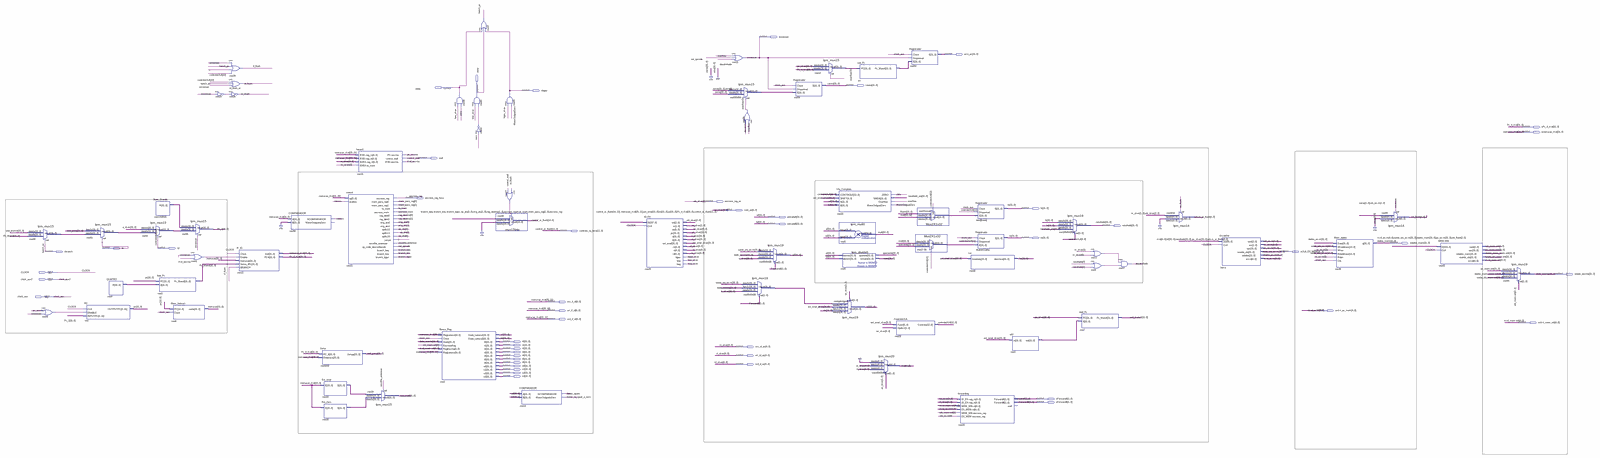
[diagram p0: schematic sheet, whole]
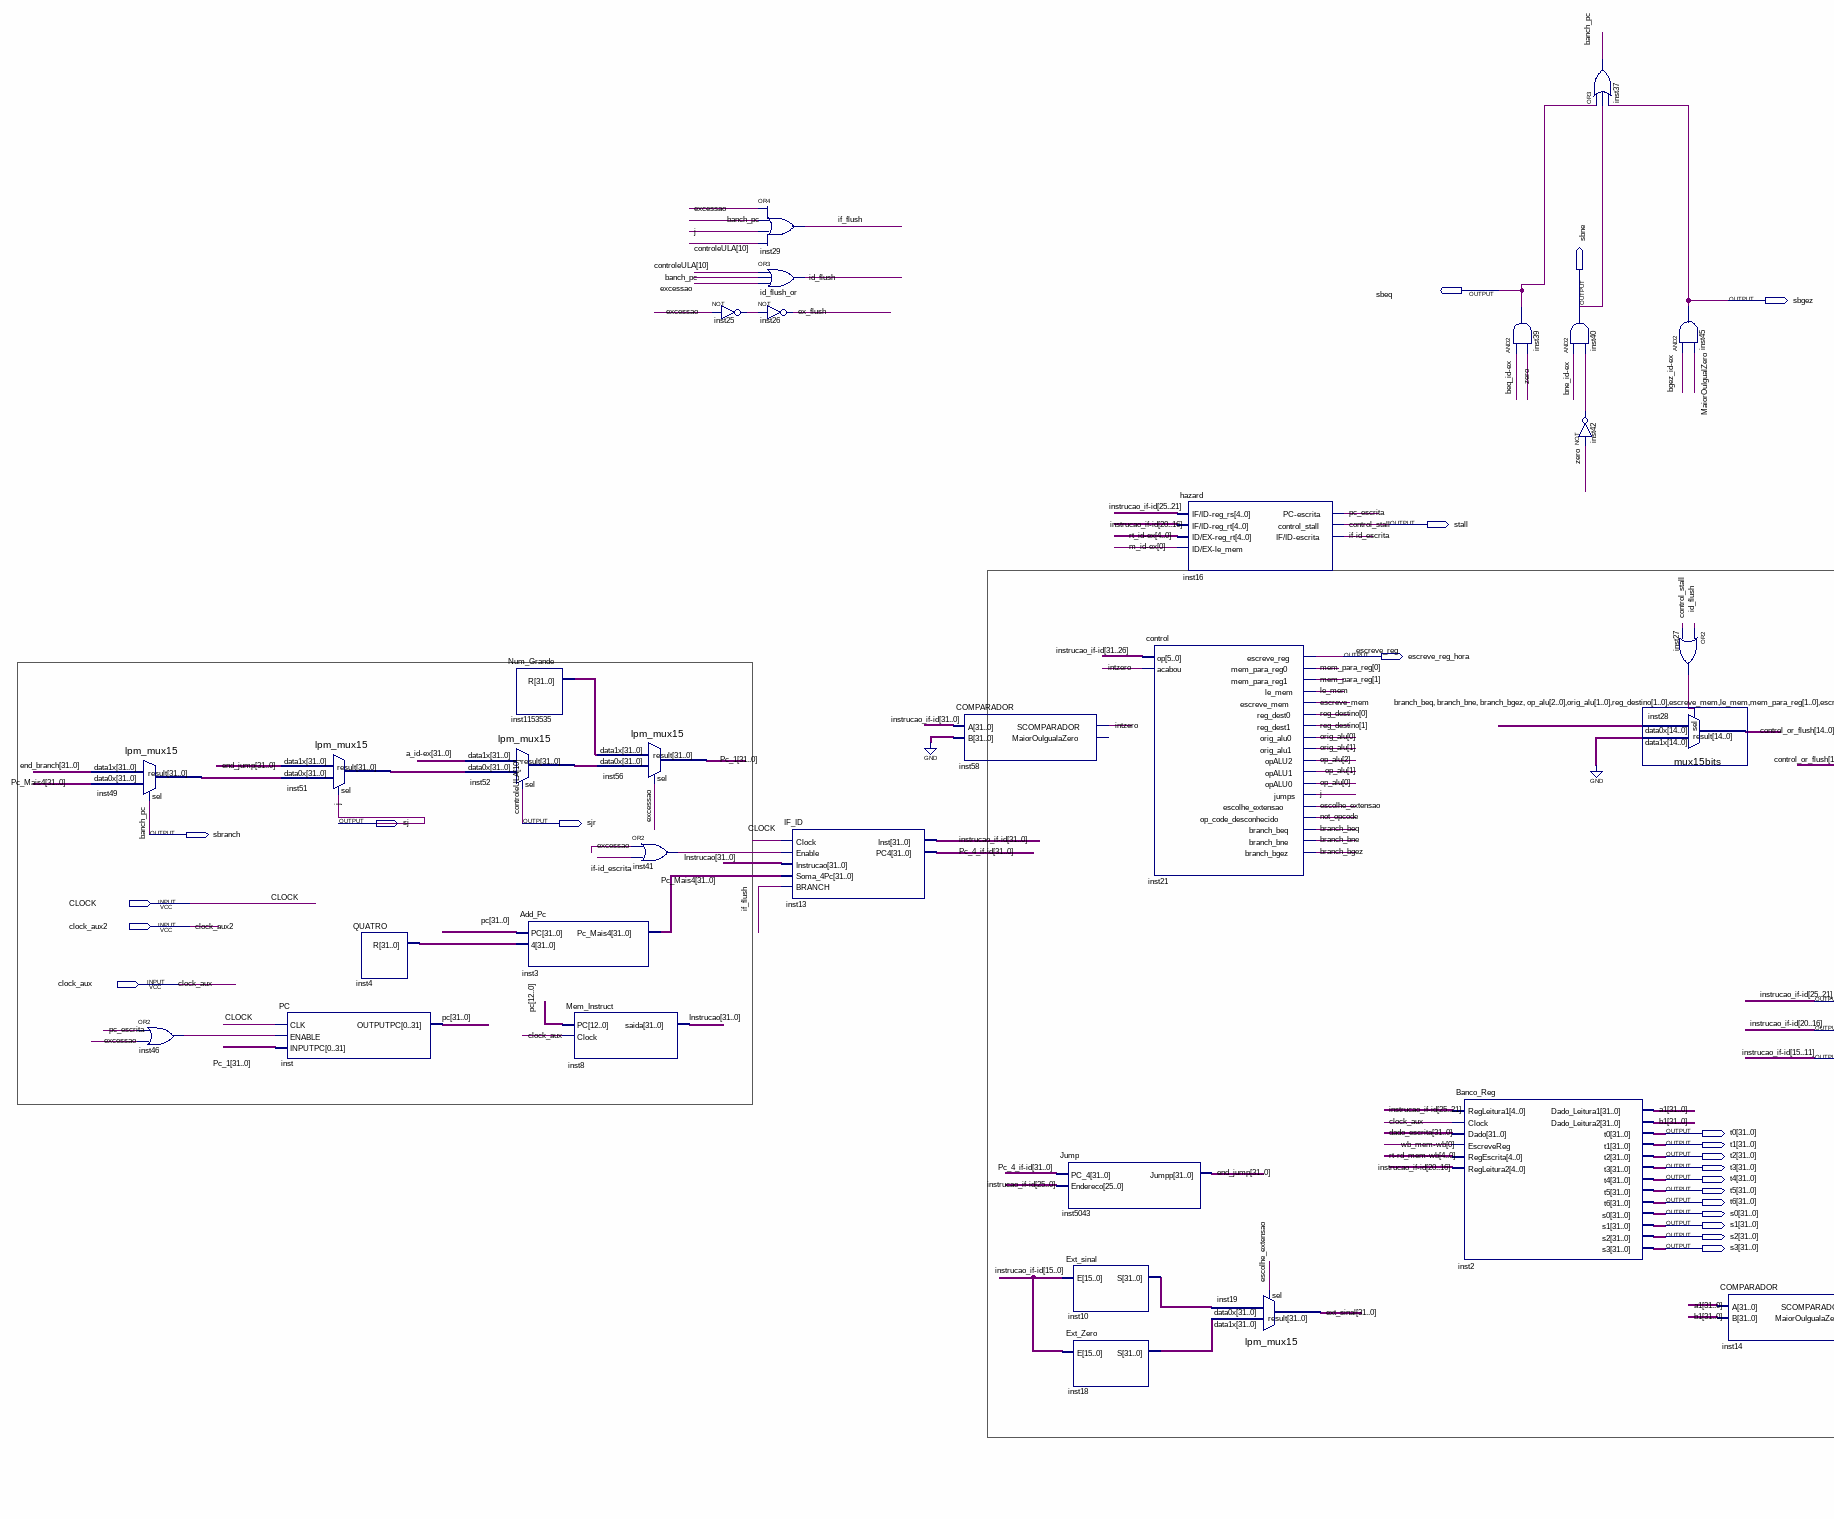
[diagram p1: schematic sheet, left part]
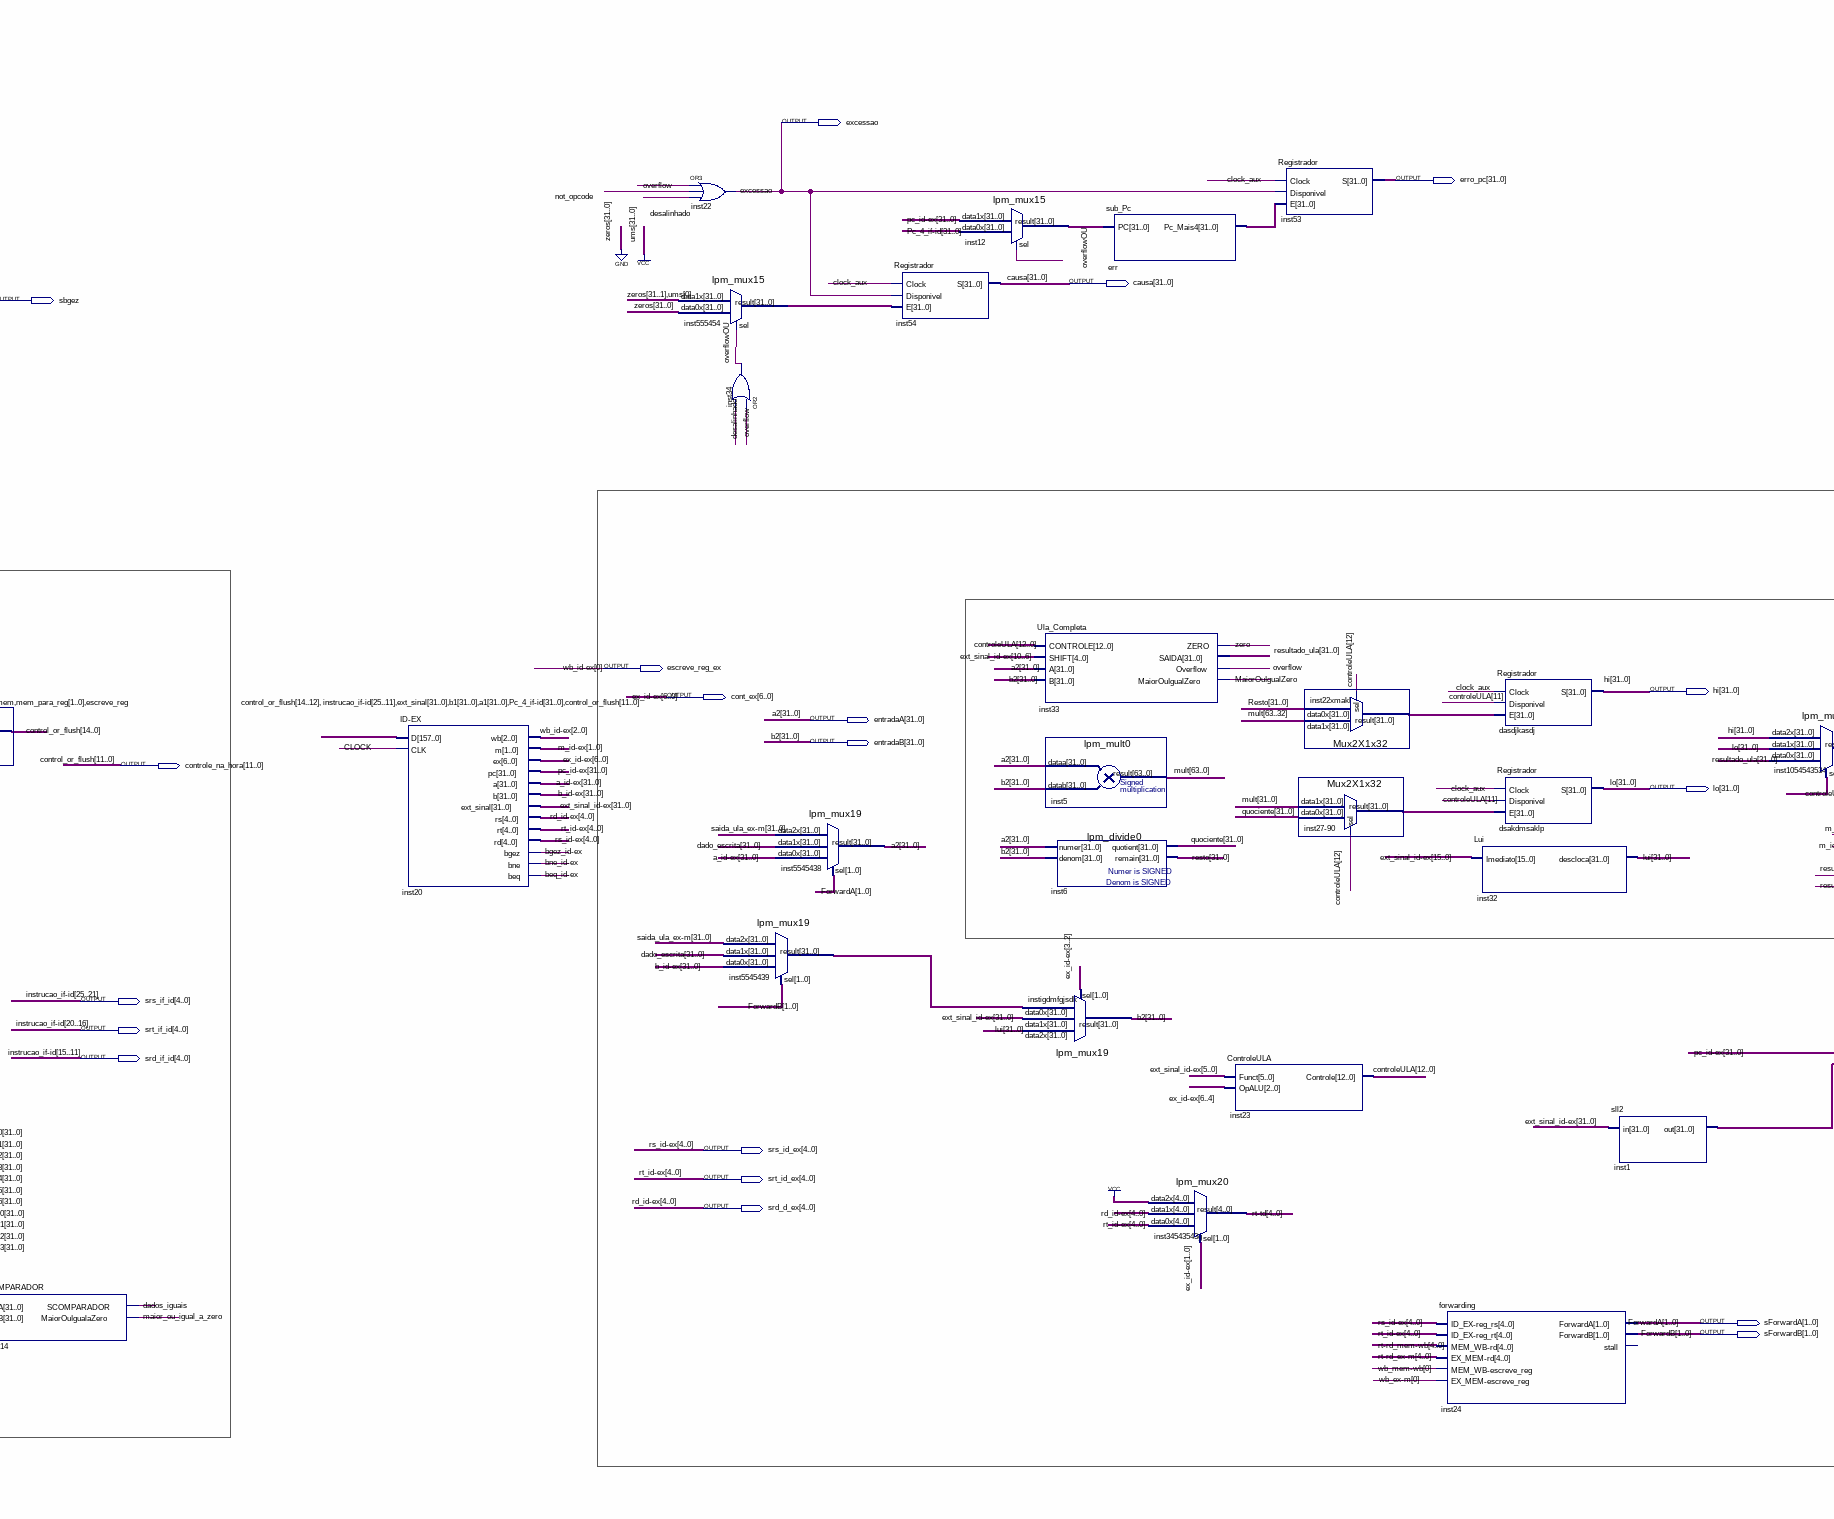
[diagram p2: schematic sheet, centre part]
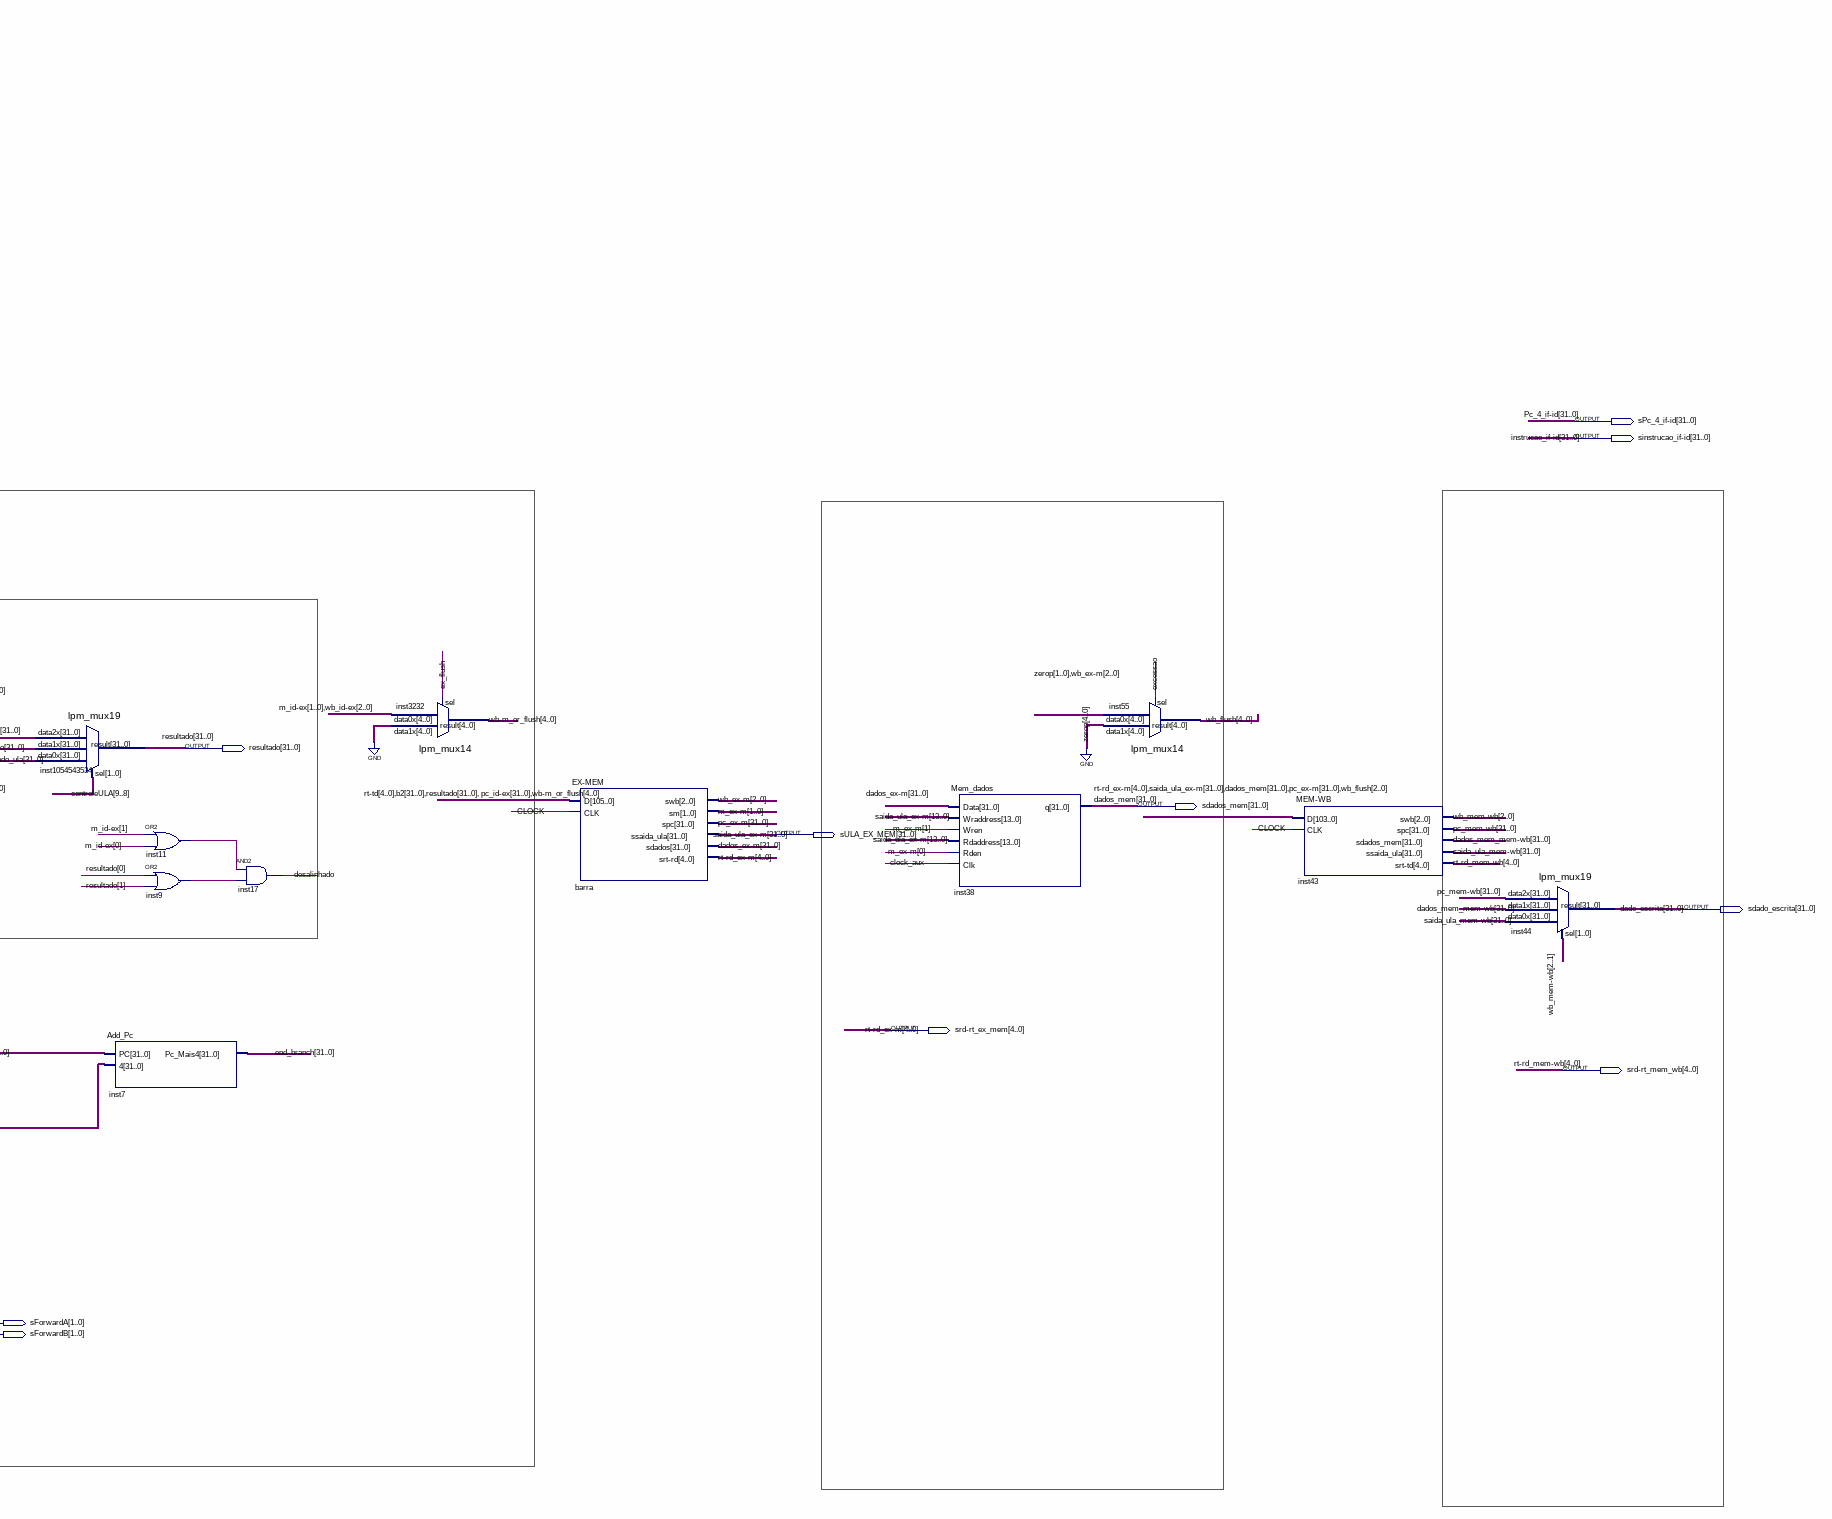
[diagram p3: schematic sheet, right part]
// Quartus schematic tudo.bdf as structural Verilog: 66 symbols, 48 pins
module tudo (
  input  CLOCK,
  input  clock_aux2,
  input  clock_aux,
  output excessao,
  output [31:0] erro_pc,
  output [31:0] causa,
  output sbeq,
  output sbgez,
  output sbne,
  output [31:0] \sPc_4_if-id ,
  output [31:0] \sinstrucao_if-id ,
  output stall,
  output escreve_reg_hora,
  output escreve_reg_ex,
  output [31:0] hi,
  output [6:0] cont_ex,
  output [31:0] entradaA,
  output [31:0] entradaB,
  output [31:0] resultado,
  output [11:0] controle_na_hora,
  output [31:0] lo,
  output [31:0] sdados_mem,
  output sj,
  output sjr,
  output sbranch,
  output [31:0] sULA_EX_MEM,
  output [31:0] sdado_escrita,
  output [4:0] srs_if_id,
  output [4:0] srt_if_id,
  output [4:0] \srd-rt_ex_mem ,
  output [4:0] srd_if_id,
  output [4:0] \srd-rt_mem_wb ,
  output [31:0] t0,
  output [31:0] t1,
  output [4:0] srs_id_ex,
  output [31:0] t2,
  output [31:0] t3,
  output [31:0] t4,
  output [4:0] srt_id_ex,
  output [31:0] t5,
  output [31:0] t6,
  output [4:0] srd_d_ex,
  output [31:0] s0,
  output [31:0] s1,
  output [31:0] s2,
  output [31:0] s3,
  output [1:0] sForwardA,
  output [1:0] sForwardB
);

  wire \beq_id-ex , \bgez_id-ex , \bne_id-ex , branch_beq, branch_bgez, branch_bne, dados_iguais,
       desalinhado, escolhe_extensao, escreve_mem, ex_flush, id_flush, \if-id_escrita , if_flush, inst9_out,
       inst11_out, inst25_out, inst27_out, inst41_out, inst42_out, inst46_out, intzero, le_mem,
       maior_ou_igual_a_zero, MaiorOuIgualZero, not_opcode, overflow, overflowOU, pc_escrita, zero;
  wire [1:0] \m_ex-m , \m_id-ex , mem_para_reg, orig_alu, reg_destino;
  wire [2:0] op_alu, \wb_ex-m , \wb_mem-wb ;
  wire [2:1] \wb_id-ex ;
  wire [4:0] \rt-td , \wb-m_or_flush , wb_flush;
  wire [12:0] controleULA;
  wire [14:12] control_or_flush;
  wire [31:0] a1, \a_id-ex , b1, \b_id-ex , \dados_ex-m , \dados_mem_mem-wb , end_branch, end_jump,
       err_pc_mais4, ext_sinal, \ext_sinal_id-ex , inst1_out, inst4_r, inst10_s, inst12_result, inst18_s,
       inst22xmakl_result, inst27_90_result, inst49_result, inst51_result, inst52_result, inst555454_result,
       inst1153535_r, inst5545439_result, Instrucao, lui, pc, Pc_1, \pc_ex-m , \pc_id-ex , Pc_Mais4,
       \pc_mem-wb , quociente, Resto, resultado_ula, \saida_ula_mem-wb ;
  wire [63:0] mult;

  lpm_mux15 inst49 (.data1x(end_branch), .data0x(Pc_Mais4), .sel(sbranch), .result(inst49_result));
  or inst46 (inst46_out, pc_escrita, excessao);
  lpm_mux15 inst51 (.data1x(end_jump), .data0x(inst49_result), .sel(sj), .result(inst51_result));
  PC inst (.CLK(CLOCK), .ENABLE(inst46_out), .INPUTPC(Pc_1), .OUTPUTPC(pc));
  QUATRO inst4 (.R(inst4_r));
  lpm_mux15 inst52 (.data1x(\a_id-ex ), .data0x(inst51_result), .sel(sjr), .result(inst52_result));
  Num_Grande inst1153535 (.R(inst1153535_r));
  Add_Pc inst3 (.PC(pc), .\4 (inst4_r), .Pc_Mais4(Pc_Mais4));
  Mem_Instruct inst8 (.PC(pc[12:0]), .Clock(clock_aux), .saida(Instrucao));
  lpm_mux15 inst56 (.data1x(inst1153535_r), .data0x(inst52_result), .sel(excessao), .result(Pc_1));
  or inst41 (inst41_out, excessao, \if-id_escrita );
  not inst25 (inst25_out, excessao);
  or inst29 (if_flush, excessao, sbranch, sj, sjr);
  or id_flush_or (id_flush, sjr, sbranch, excessao);
  not inst26 (ex_flush, inst25_out);
  IF_ID inst13 (
    .Clock(CLOCK), .Enable(inst41_out), .Instrucao(Instrucao), .Soma_4Pc(Pc_Mais4), .BRANCH(if_flush),
    .Inst(\sinstrucao_if-id ), .PC4(\sPc_4_if-id ));
  COMPARADOR inst58 (.A(\sinstrucao_if-id ), .B({32{1'b0}}), .SCOMPARADOR(intzero));  // open: MaiorOuIgualaZero
  Jump inst5043 (.PC_4(\sPc_4_if-id ), .Endereco(\sinstrucao_if-id [25:0]), .Jumpp(end_jump));
  Ext_sinal inst10 (.E(\sinstrucao_if-id [15:0]), .S(inst10_s));
  Ext_Zero inst18 (.E(\sinstrucao_if-id [15:0]), .S(inst18_s));
  control inst21 (
    .op(\sinstrucao_if-id [31:26]), .acabou(intzero), .escreve_reg(escreve_reg_hora),
    .mem_para_reg0(mem_para_reg[0]), .mem_para_reg1(mem_para_reg[1]), .le_mem(le_mem),
    .escreve_mem(escreve_mem), .reg_dest0(reg_destino[0]), .reg_dest1(reg_destino[1]),
    .orig_alu0(orig_alu[0]), .orig_alu1(orig_alu[1]), .opALU2(op_alu[2]), .opALU1(op_alu[1]),
    .opALU0(op_alu[0]), .jumps(sj), .escolhe_extensao(escolhe_extensao), .op_code_desconhecido(not_opcode),
    .branch_beq(branch_beq), .branch_bne(branch_bne), .branch_bgez(branch_bgez));
  hazard inst16 (
    .\IF/ID-reg_rs (\sinstrucao_if-id [25:21]), .\IF/ID-reg_rt (\sinstrucao_if-id [20:16]),
    .\ID/EX-reg_rt (srt_id_ex), .\ID/EX-le_mem (\m_id-ex [0]), .\PC-escrita (pc_escrita),
    .control_stall(stall), .\IF/ID-escrita (\if-id_escrita ));
  lpm_mux15 inst19 (.data1x(inst18_s), .data0x(inst10_s), .sel(escolhe_extensao), .result(ext_sinal));
  Banco_Reg inst2 (
    .RegLeitura1(\sinstrucao_if-id [25:21]), .Clock(clock_aux), .Dado(sdado_escrita),
    .EscreveReg(\wb_mem-wb [0]), .RegEscrita(\srd-rt_mem_wb ), .RegLeitura2(\sinstrucao_if-id [20:16]),
    .Dado_Leitura1(a1), .Dado_Leitura2(b1), .t0(t0), .t1(t1), .t2(t2), .t3(t3), .t4(t4), .t5(t5), .t6(t6),
    .s0(s0), .s1(s1), .s2(s2), .s3(s3));
  and inst39 (sbeq, \beq_id-ex , zero);
  and inst40 (sbne, \bne_id-ex , inst42_out);
  not inst42 (inst42_out, zero);
  or inst37 (sbranch, sbeq, sbne, sbgez);
  mux15bits inst28 (
    .data1x({15{1'b0}}),
    .data0x({branch_beq, branch_bne, branch_bgez, op_alu, orig_alu, reg_destino, escreve_mem, le_mem, mem_para_reg, escreve_reg_hora}),
    .sel(inst27_out), .result({control_or_flush, controle_na_hora}));
  and inst45 (sbgez, \bgez_id-ex , MaiorOuIgualZero);
  or inst27 (inst27_out, id_flush, stall);
  COMPARADOR inst14 (.A(a1), .B(b1), .SCOMPARADOR(dados_iguais), .MaiorOuIgualaZero(maior_ou_igual_a_zero));
  \ID-EX  inst20 (
    .D({control_or_flush, \sinstrucao_if-id [25:11], ext_sinal, b1, a1, \sPc_4_if-id , controle_na_hora}),
    .CLK(CLOCK), .wb({\wb_id-ex , escreve_reg_ex}), .m(\m_id-ex ), .ex(cont_ex), .pc(\pc_id-ex ),
    .a(\a_id-ex ), .b(\b_id-ex ), .ext_sinal(\ext_sinal_id-ex ), .rs(srd_d_ex), .rt(srt_id_ex),
    .rd(srs_id_ex), .bgez(\bgez_id-ex ), .bne(\bne_id-ex ), .beq(\beq_id-ex ));
  or inst22 (excessao, overflow, not_opcode, desalinhado);
  lpm_mux15 inst555454 (
    .data1x(32'b00000000000000000000000000000001), .data0x({32{1'b0}}), .sel(overflowOU),
    .result(inst555454_result));
  or inst34 (overflowOU, overflow, desalinhado);
  lpm_mux19 inst5545439 (
    .data2x(sULA_EX_MEM), .data1x(sdado_escrita), .data0x(\b_id-ex ), .sel(sForwardB),
    .result(inst5545439_result));
  lpm_mux19 inst5545438 (
    .data2x(sULA_EX_MEM), .data1x(sdado_escrita), .data0x(\a_id-ex ), .sel(sForwardA), .result(entradaA));
  Registrador inst54 (.Clock(clock_aux), .Disponivel(excessao), .E(inst555454_result), .S(causa));
  lpm_mux15 inst12 (.data1x(\pc_id-ex ), .data0x(\sPc_4_if-id ), .sel(overflowOU), .result(inst12_result));
  Ula_Completa inst33 (
    .CONTROLE({controleULA[12:11], sjr, controleULA[9:0]}), .SHIFT(\ext_sinal_id-ex [10:6]), .A(entradaA),
    .B(entradaB), .ZERO(zero), .SAIDA(resultado_ula), .Overflow(overflow), .MaiorOuIgualZero(MaiorOuIgualZero));
  lpm_mux19 instigdmfgjsdk (
    .data2x(lui), .data1x(\ext_sinal_id-ex ), .data0x(inst5545439_result), .sel(cont_ex[3:2]),
    .result(entradaB));
  lpm_mult0 inst5 (.dataa(entradaA), .datab(entradaB), .result(mult));
  lpm_divide0 inst6 (.numer(entradaA), .denom(entradaB), .quotient(quociente), .remain(Resto));
  sub_Pc err (.PC(inst12_result), .Pc_Mais4(err_pc_mais4));
  lpm_mux20 inst34543543g (
    .data2x({5{1'b1}}), .data1x(srd_d_ex), .data0x(srt_id_ex), .sel(cont_ex[1:0]), .result(\rt-td ));
  ControleULA inst23 (
    .Funct(\ext_sinal_id-ex [5:0]), .OpALU(cont_ex[6:4]),
    .Controle({controleULA[12:11], sjr, controleULA[9:0]}));
  Registrador inst53 (.Clock(clock_aux), .Disponivel(excessao), .E(err_pc_mais4), .S(erro_pc));
  Mux2X1x32 inst22xmakl (.data1x(mult[63:32]), .data0x(Resto), .sel(controleULA[12]), .result(inst22xmakl_result));
  Mux2X1x32 \inst27-90  (.data1x(mult[31:0]), .data0x(quociente), .sel(controleULA[12]), .result(inst27_90_result));
  forwarding inst24 (
    .\ID_EX-reg_rs (srs_id_ex), .\ID_EX-reg_rt (srt_id_ex), .\MEM_WB-rd (\srd-rt_mem_wb ),
    .\EX_MEM-rd (\srd-rt_ex_mem ), .\MEM_WB-escreve_reg (\wb_mem-wb [0]),
    .\EX_MEM-escreve_reg (\wb_ex-m [0]), .ForwardA(sForwardA), .ForwardB(sForwardB));  // open: stall
  Registrador dasdjkasdj (.Clock(clock_aux), .Disponivel(controleULA[11]), .E(inst22xmakl_result), .S(hi));
  Registrador dsakdmsaklp (.Clock(clock_aux), .Disponivel(controleULA[11]), .E(inst27_90_result), .S(lo));
  Lui inst32 (.Imediato(\ext_sinal_id-ex [15:0]), .descloca(lui));
  sll2 inst1 (.in(\ext_sinal_id-ex ), .out(inst1_out));
  lpm_mux19 inst1054543534 (
    .data2x(hi), .data1x(lo), .data0x(resultado_ula), .sel(controleULA[9:8]), .result(resultado));
  Add_Pc inst7 (.PC(\pc_id-ex ), .\4 (inst1_out), .Pc_Mais4(end_branch));
  or inst11 (inst11_out, \m_id-ex [1], \m_id-ex [0]);
  or inst9 (inst9_out, resultado[0], resultado[1]);
  and inst17 (desalinhado, inst11_out, inst9_out);
  lpm_mux14 inst3232 (
    .data1x({5{1'b0}}), .data0x({\m_id-ex , \wb_id-ex , escreve_reg_ex}), .sel(ex_flush),
    .result(\wb-m_or_flush ));
  \EX-MEM  barra (
    .D({\rt-td , entradaB, resultado, \pc_id-ex , \wb-m_or_flush }), .CLK(CLOCK), .swb(\wb_ex-m ),
    .sm(\m_ex-m ), .spc(\pc_ex-m ), .ssaida_ula(sULA_EX_MEM), .sdados(\dados_ex-m ),
    .\srt-rd (\srd-rt_ex_mem ));
  Mem_dados inst38 (
    .Data(\dados_ex-m ), .Wraddress(sULA_EX_MEM[13:0]), .Wren(\m_ex-m [1]), .Rdaddress(sULA_EX_MEM[13:0]),
    .Rden(\m_ex-m [0]), .Clk(clock_aux), .q(sdados_mem));
  lpm_mux14 inst55 (.data1x({5{1'b0}}), .data0x({2'b00, \wb_ex-m }), .sel(excessao), .result(wb_flush));
  \MEM-WB  inst43 (
    .D({\srd-rt_ex_mem , sULA_EX_MEM, sdados_mem, \pc_ex-m , wb_flush[2:0]}), .CLK(CLOCK), .swb(\wb_mem-wb ),
    .spc(\pc_mem-wb ), .sdados_mem(\dados_mem_mem-wb ), .ssaida_ula(\saida_ula_mem-wb ),
    .\srt-td (\srd-rt_mem_wb ));
  lpm_mux19 inst44 (
    .data2x(\pc_mem-wb ), .data1x(\dados_mem_mem-wb ), .data0x(\saida_ula_mem-wb ), .sel(\wb_mem-wb [2:1]),
    .result(sdado_escrita));

  assign srd_if_id = \sinstrucao_if-id [15:11];
  assign srs_if_id = \sinstrucao_if-id [25:21];
  assign srt_if_id = \sinstrucao_if-id [20:16];

  // Other names for the same wires on the sheet: a2[31:0] = entradaA; b2[31:0] = entradaB; banch_pc = sbranch;
  //   control_or_flush[11:0] = controle_na_hora; control_stall = stall; controleULA[10] = sjr;
  //   dado_escrita[31:0] = sdado_escrita; dados_mem[31:0] = sdados_mem; escreve_reg = escreve_reg_hora;
  //   ex_id-ex[6:0] = cont_ex; ForwardA[1:0] = sForwardA; ForwardB[1:0] = sForwardB;
  //   instrucao_if-id[31:0] = \sinstrucao_if-id ; j = sj; Pc_4_if-id[31:0] = \sPc_4_if-id ; rd_id-ex[4:0] = srd_d_ex;
  //   rs_id-ex[4:0] = srs_id_ex; rt-rd_ex-m[4:0] = \srd-rt_ex_mem ; rt-rd_mem-wb[4:0] = \srd-rt_mem_wb ;
  //   rt_id-ex[4:0] = srt_id_ex; saida_ula_ex-m[31:0] = sULA_EX_MEM; wb_id-ex[0] = escreve_reg_ex
endmodule
